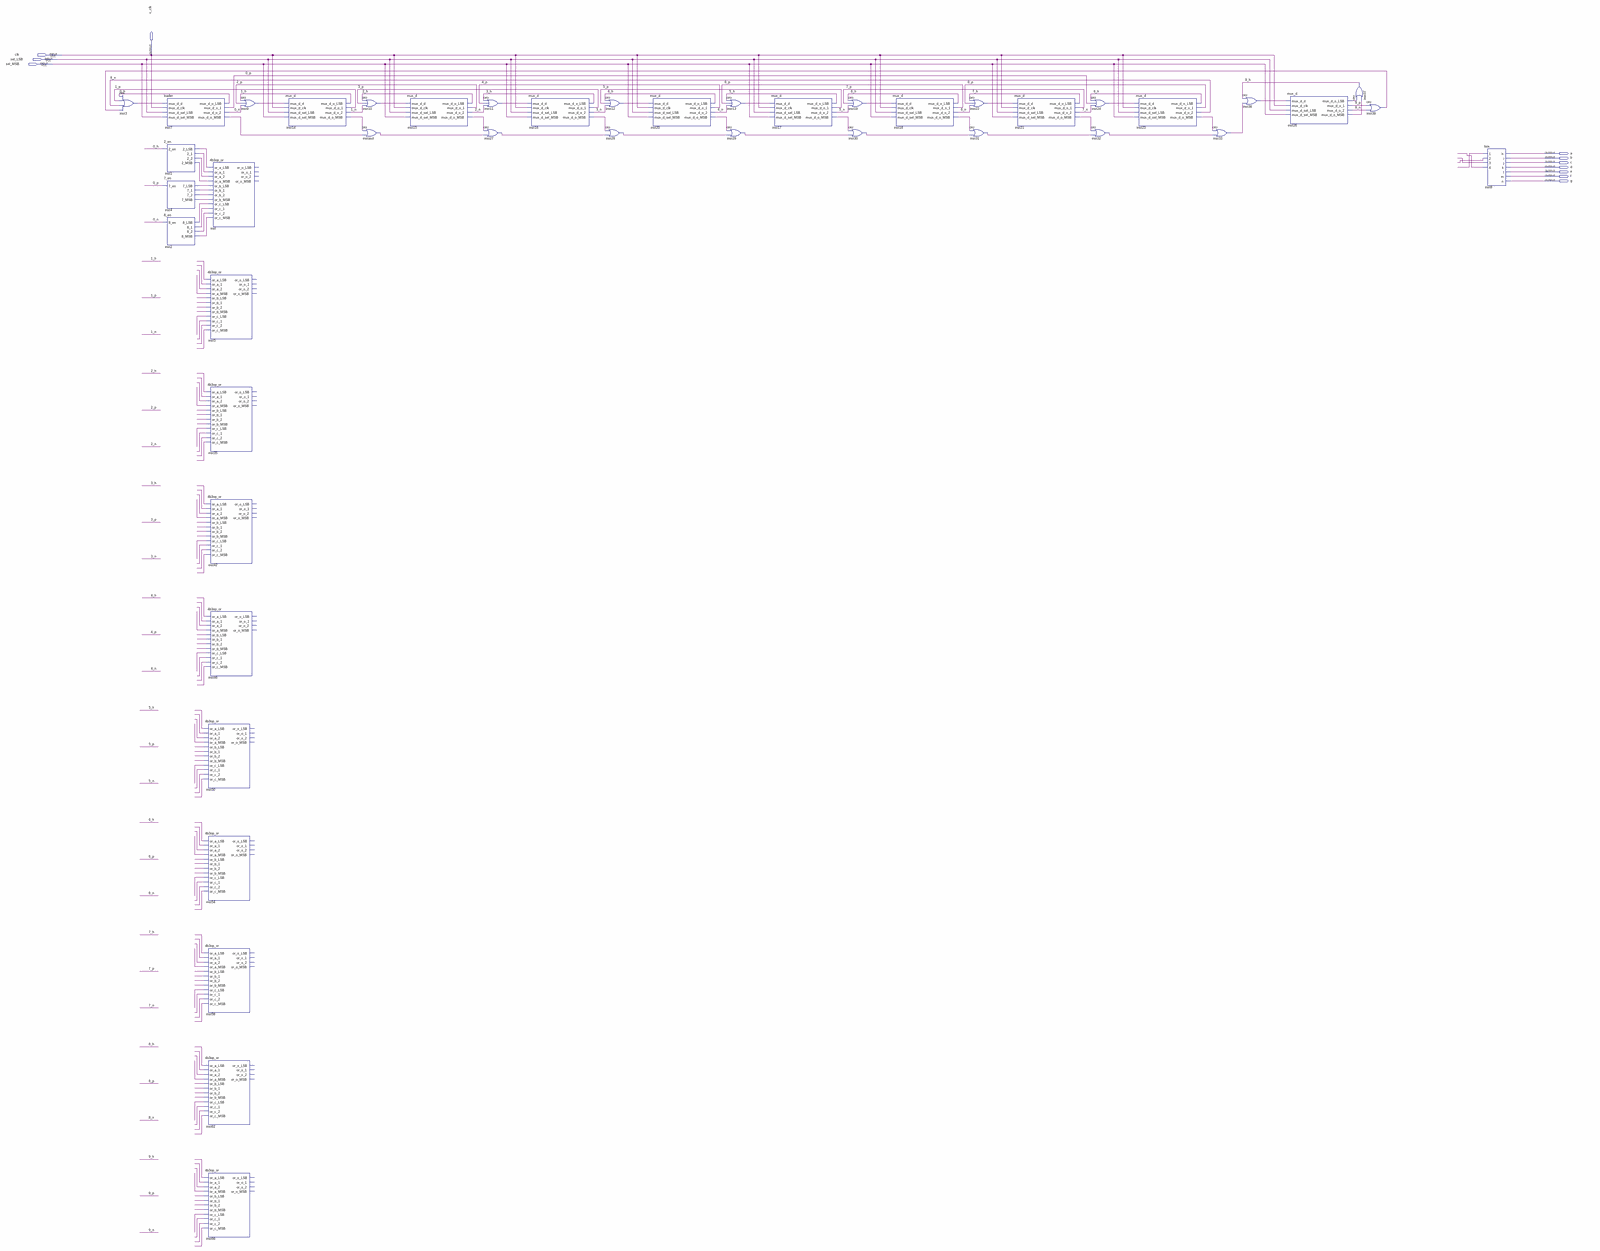
[diagram p0: schematic sheet, whole]
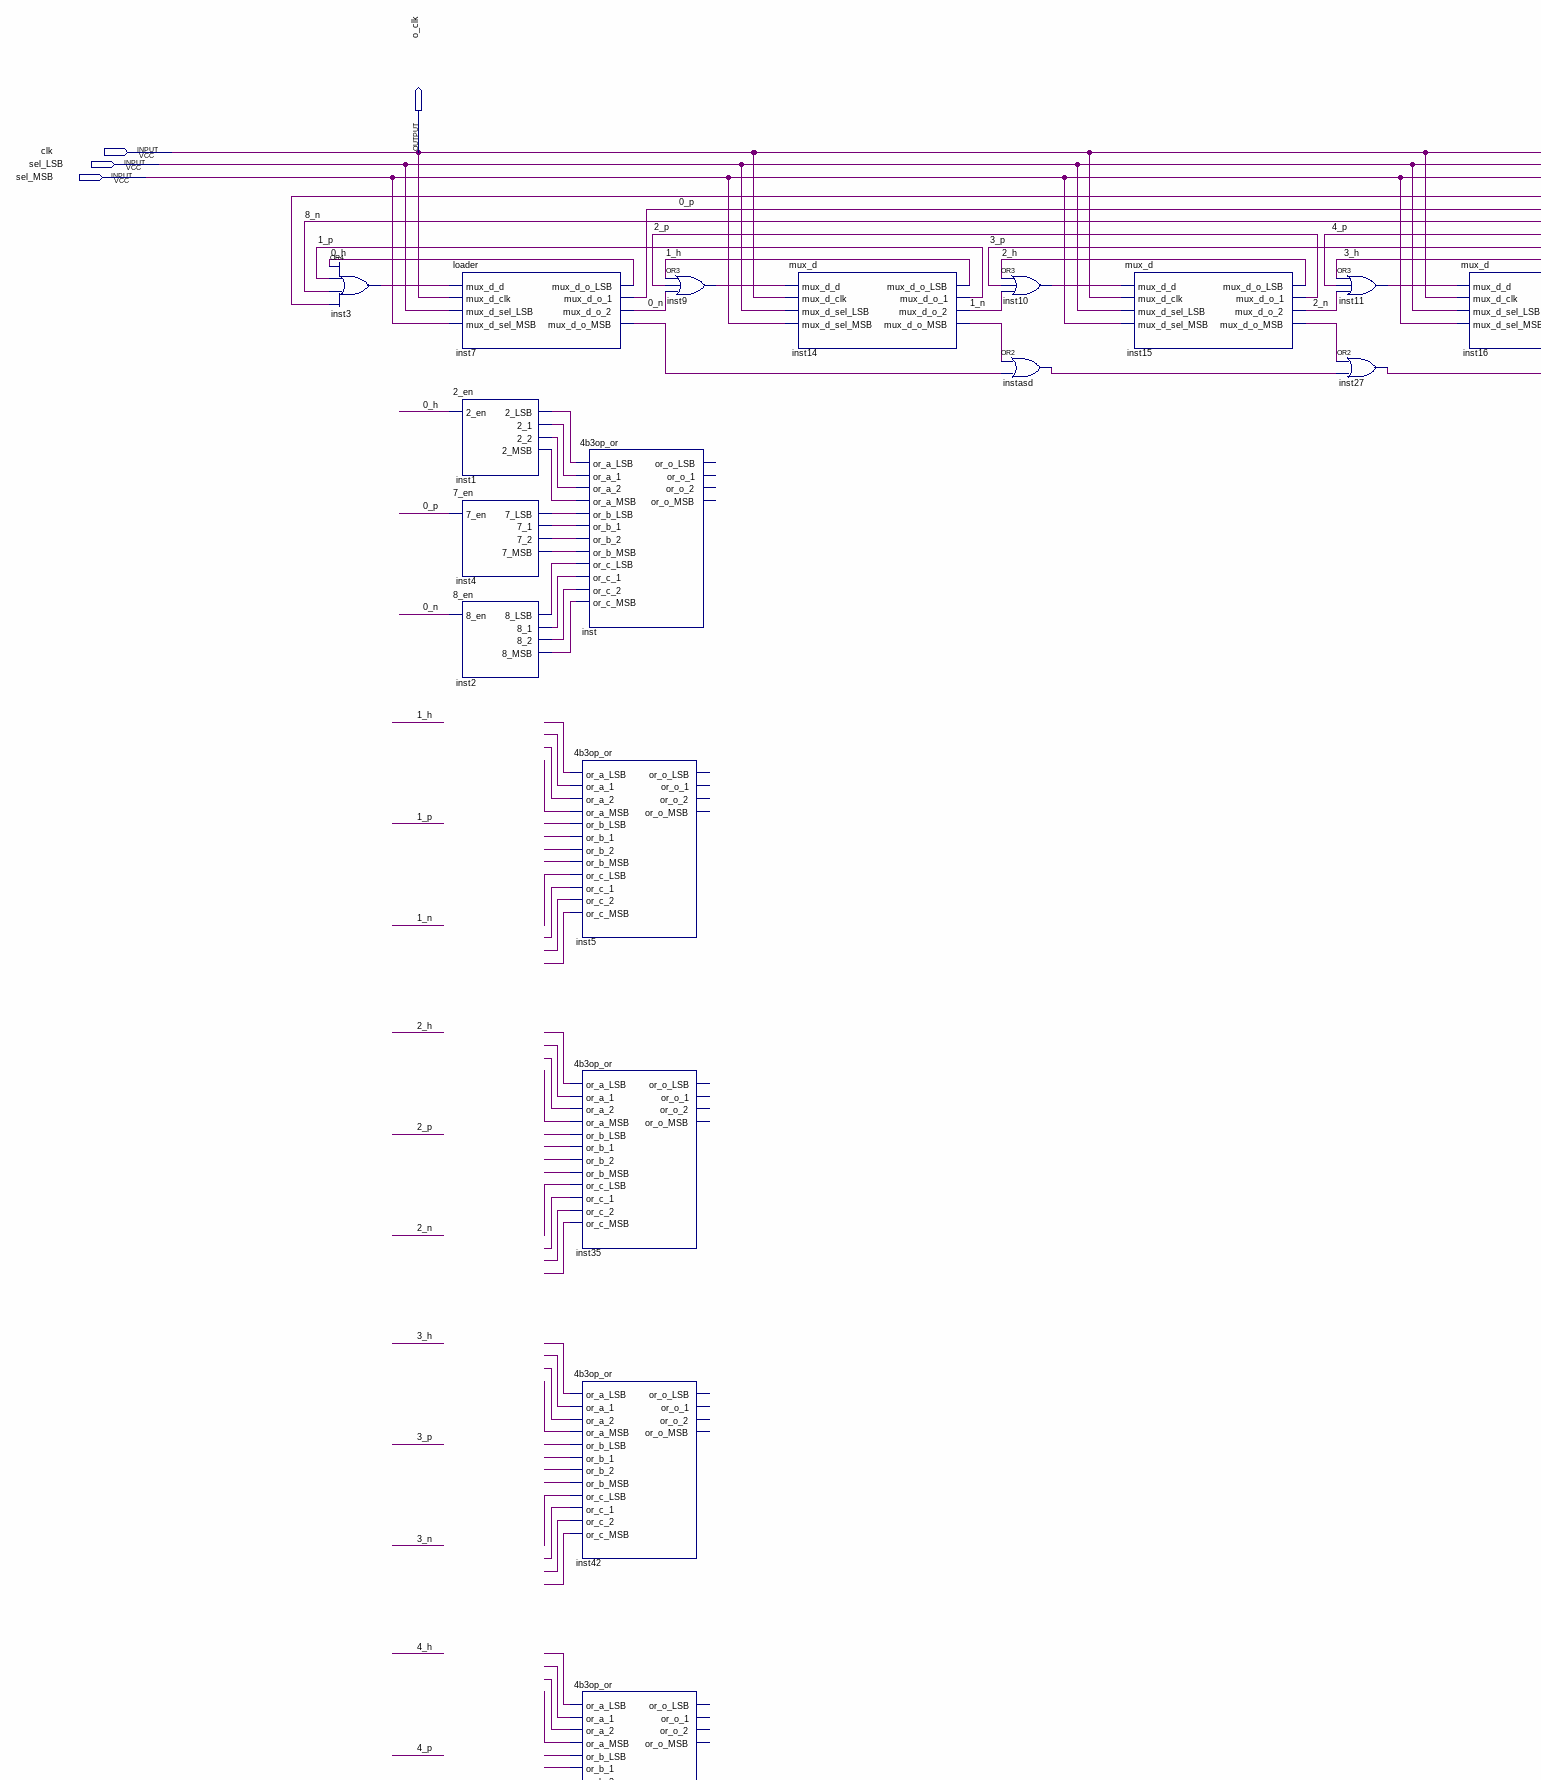
[diagram p1: schematic sheet, upper left part]
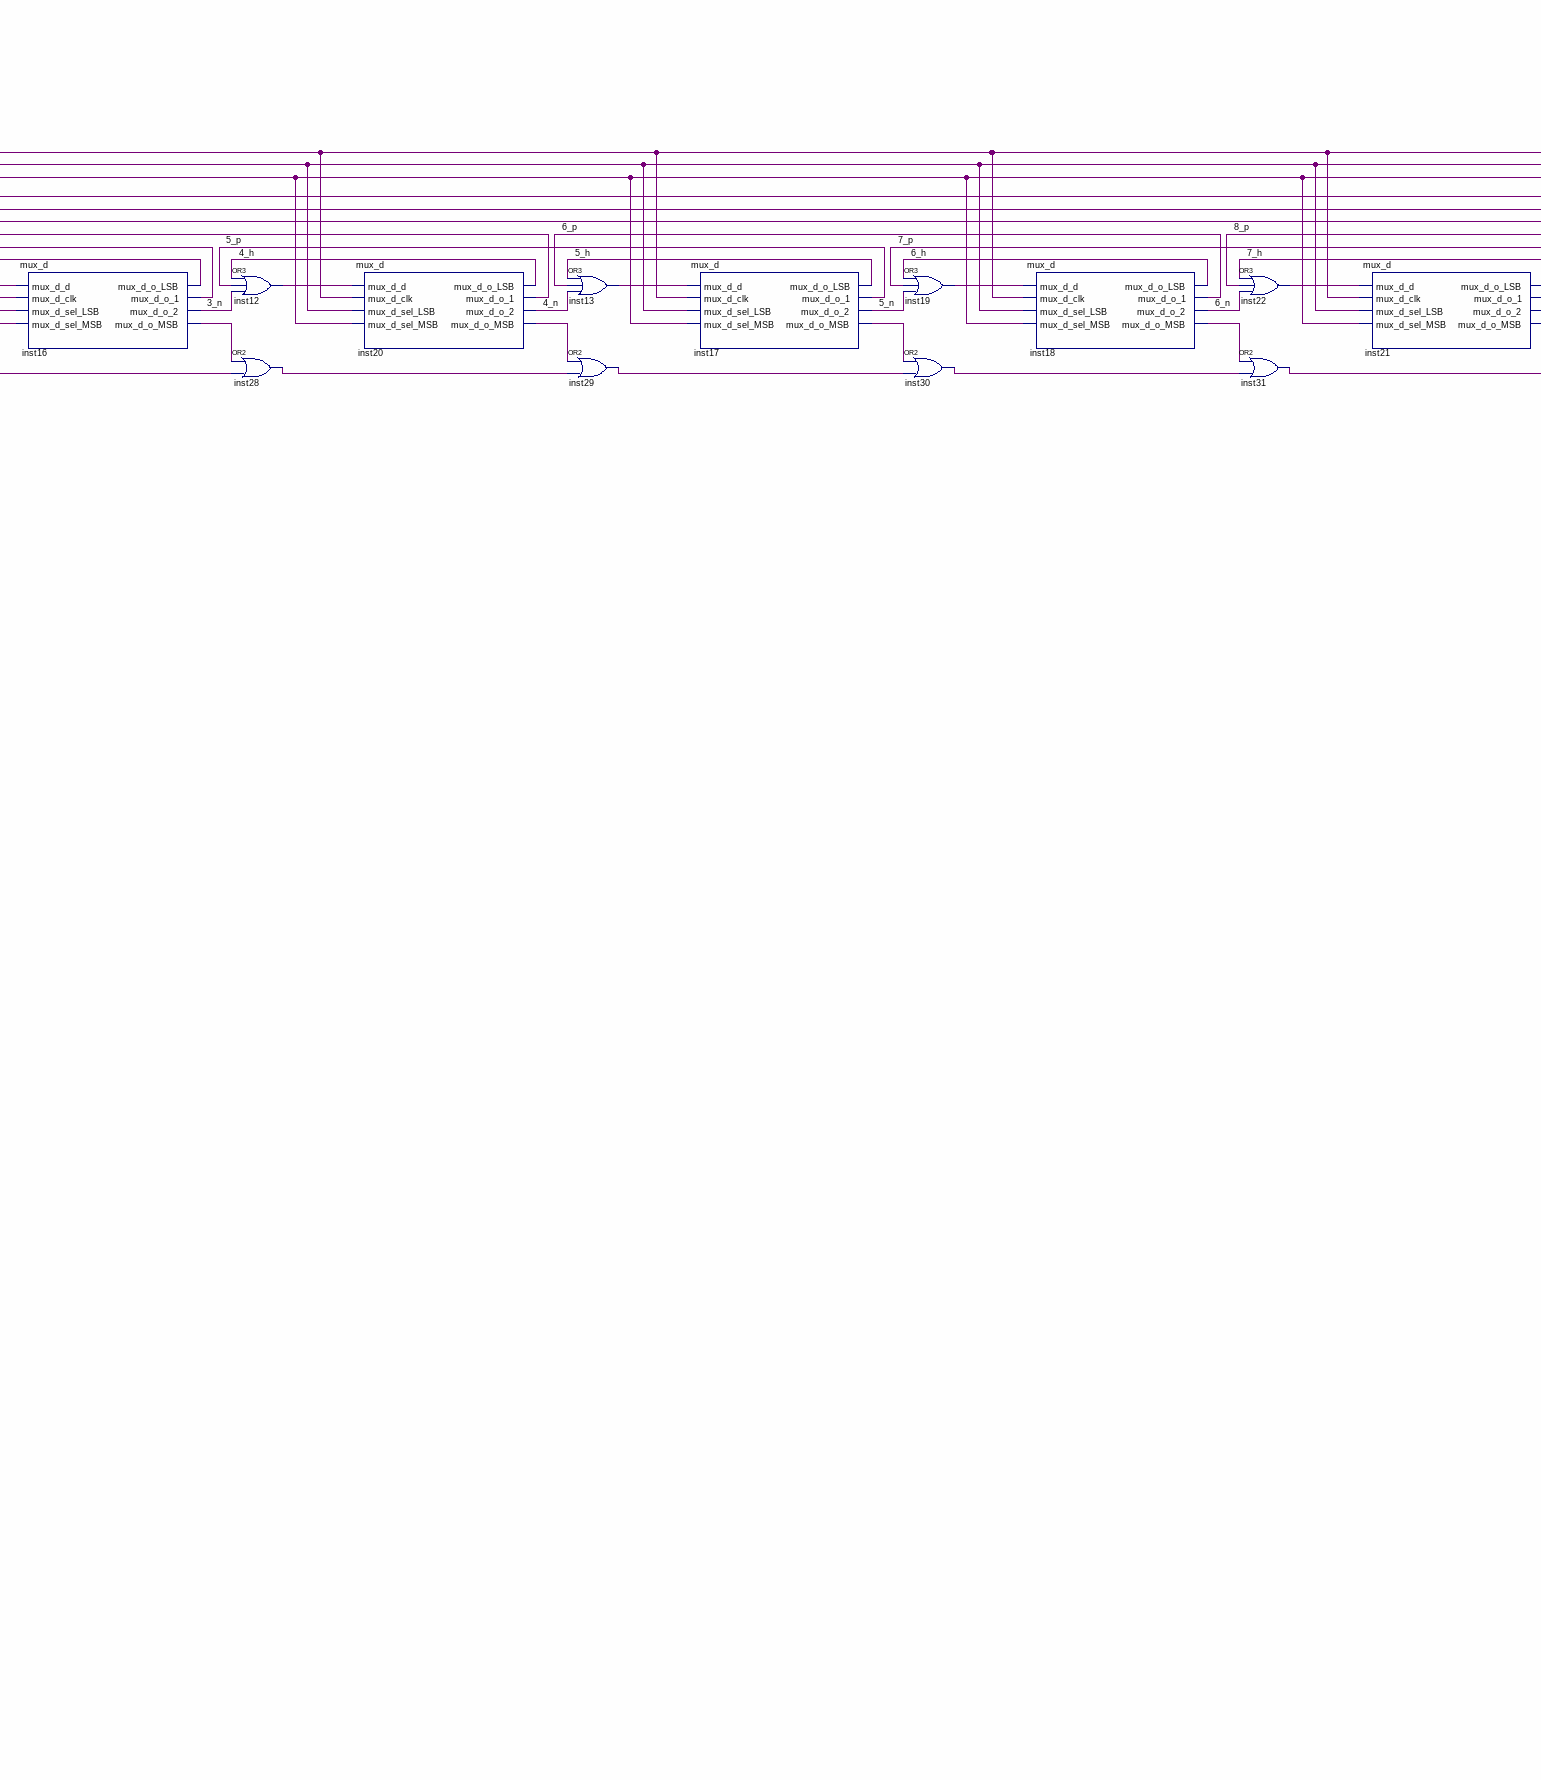
[diagram p2: schematic sheet, upper centre part]
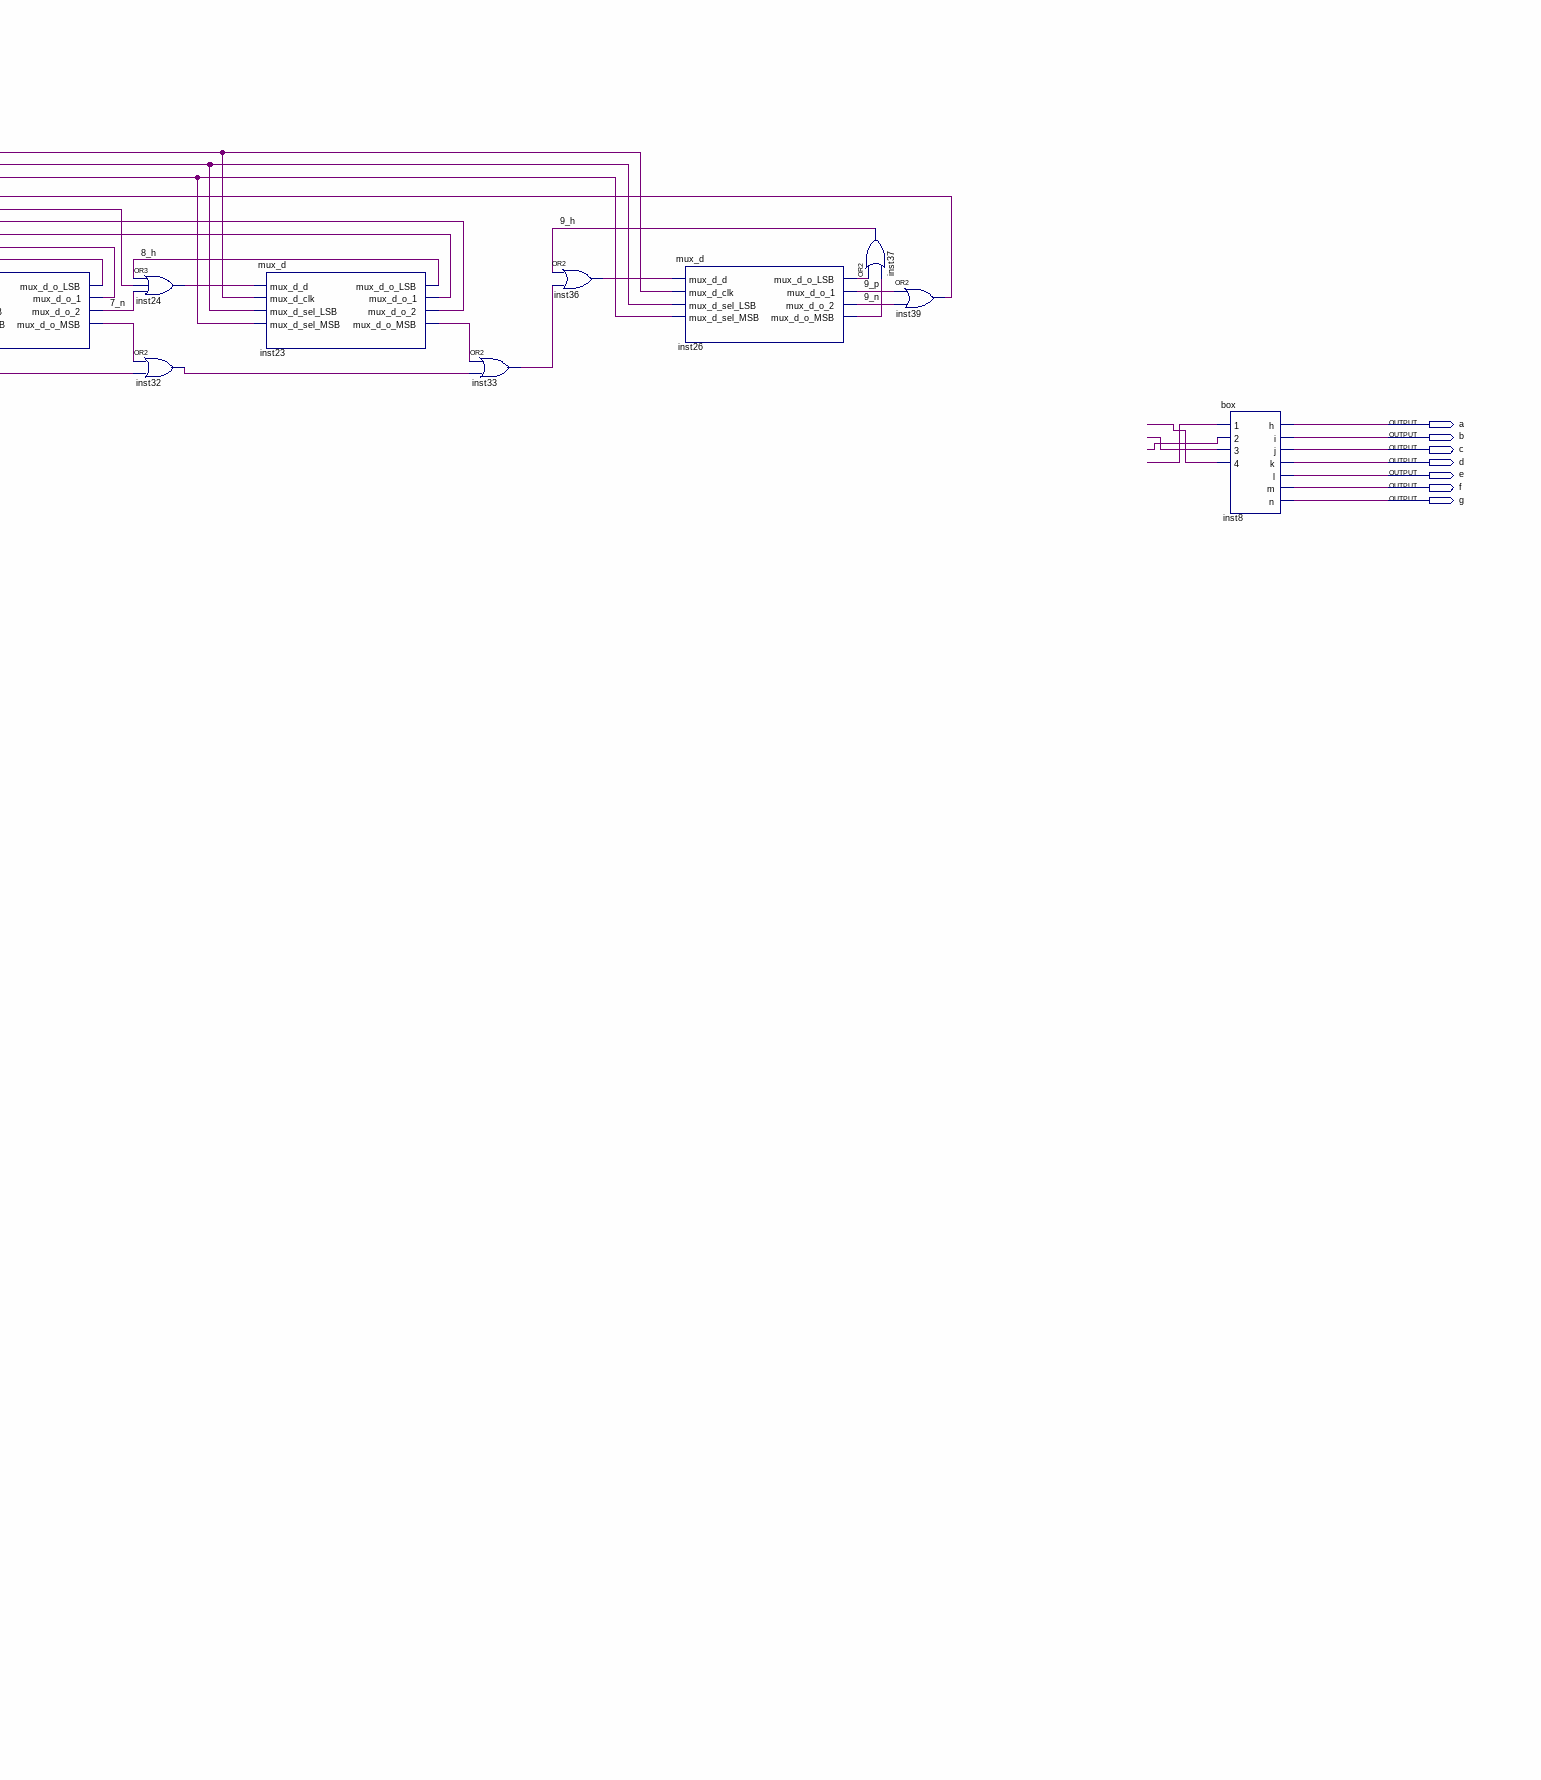
[diagram p3: schematic sheet, upper right part]
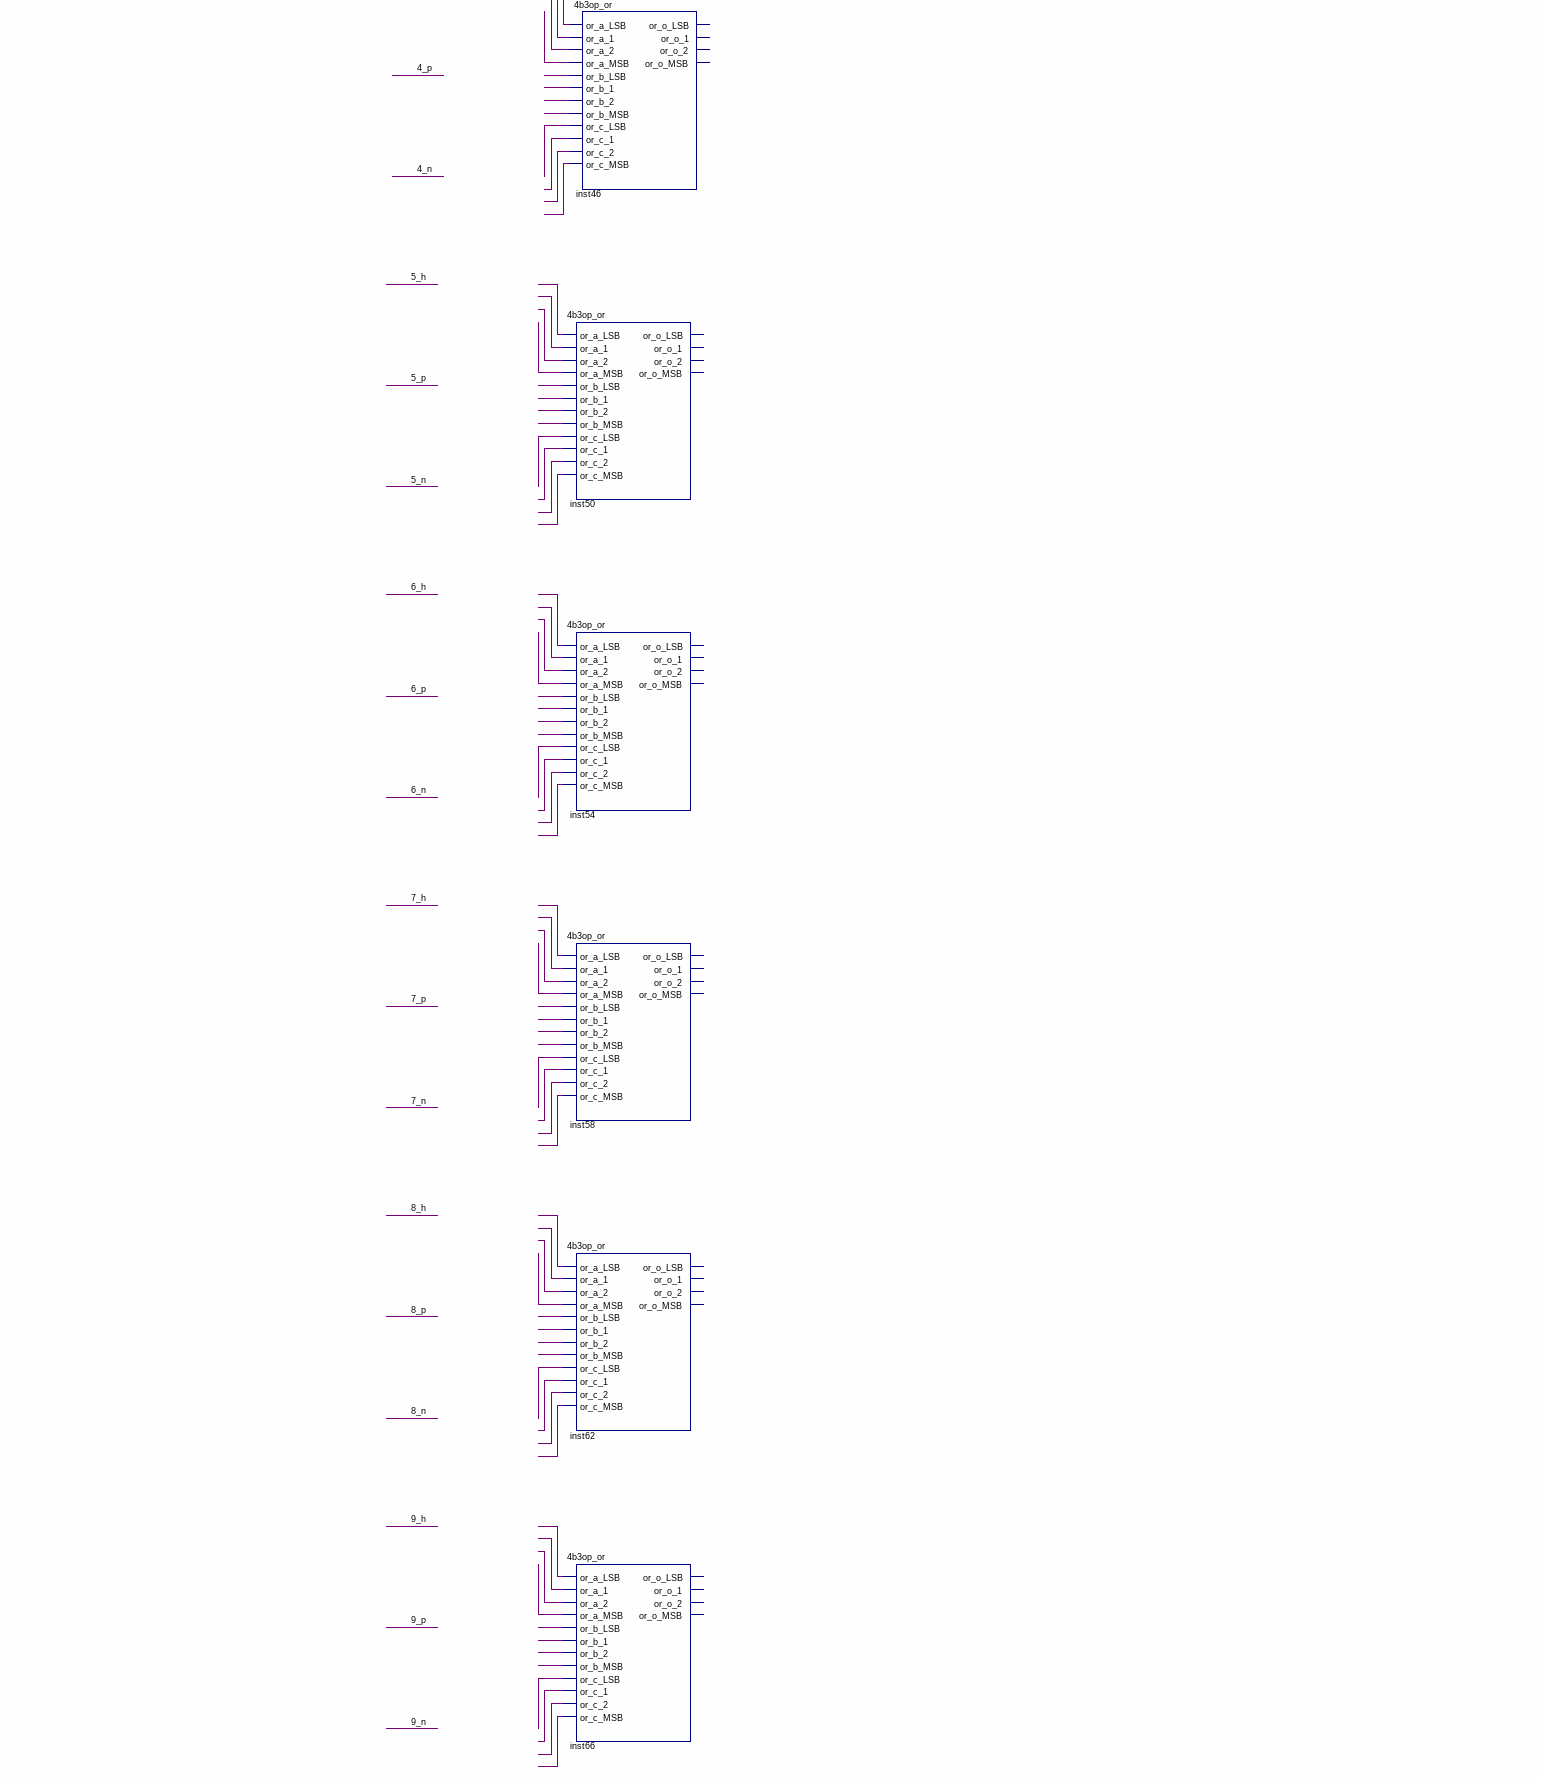
[diagram p4: schematic sheet, lower left part]
// Quartus schematic bcd.bdf as structural Verilog: 44 symbols, 11 pins
module bcd (
  input  clk,
  input  sel_LSB,
  input  sel_MSB,
  output o_clk,
  output a,
  output b,
  output c,
  output d,
  output e,
  output f,
  output g
);

  wire \0_h , \0_n , \0_p , \1_h , \1_n , \1_p , \2_h , \2_n , \2_p , \3_h , \3_n , \3_p , \4_h , \4_n ,
       \4_p , \5_h , \5_n , \5_p , \6_h , \6_n , \6_p , \7_h , \7_n , \7_p , \8_h , \8_n , \8_p , \9_h ,
       \9_n , \9_p , inst1_2_1, inst1_2_2, inst1_2_lsb, inst1_2_msb, inst2_8_1, inst2_8_2, inst2_8_lsb,
       inst2_8_msb, inst3_out, inst4_7_1, inst4_7_2, inst4_7_lsb, inst4_7_msb, inst7_mux_d_o_msb, inst9_out,
       inst10_out, inst11_out, inst12_out, inst13_out, inst14_mux_d_o_msb, inst15_mux_d_o_msb,
       inst16_mux_d_o_msb, inst17_mux_d_o_msb, inst18_mux_d_o_msb, inst19_out, inst20_mux_d_o_msb,
       inst21_mux_d_o_msb, inst22_out, inst23_mux_d_o_msb, inst24_out, inst26_mux_d_o_lsb,
       inst26_mux_d_o_msb, inst27_out, inst28_out, inst29_out, inst30_out, inst31_out, inst32_out,
       inst33_out, inst36_out, inst39_out, instasd_out, undriven, undriven_2, undriven_3, undriven_4,
       undriven_5, undriven_6, undriven_7, undriven_8, undriven_9, undriven_10, undriven_11, undriven_12,
       undriven_13, undriven_14, undriven_15, undriven_16, undriven_17, undriven_18, undriven_19,
       undriven_20, undriven_21, undriven_22, undriven_23, undriven_24, undriven_25, undriven_26,
       undriven_27, undriven_28, undriven_29, undriven_30, undriven_31, undriven_32, undriven_33,
       undriven_34, undriven_35, undriven_36, undriven_37, undriven_38, undriven_39, undriven_40,
       undriven_41, undriven_42, undriven_43, undriven_44, undriven_45, undriven_46, undriven_47,
       undriven_48, undriven_49, undriven_50, undriven_51, undriven_52, undriven_53, undriven_54,
       undriven_55, undriven_56, undriven_57, undriven_58, undriven_59, undriven_60, undriven_61,
       undriven_62, undriven_63, undriven_64, undriven_65, undriven_66, undriven_67, undriven_68,
       undriven_69, undriven_70, undriven_71, undriven_72, undriven_73, undriven_74, undriven_75,
       undriven_76, undriven_77, undriven_78, undriven_79, undriven_80, undriven_81, undriven_82,
       undriven_83, undriven_84, undriven_85, undriven_86, undriven_87, undriven_88, undriven_89,
       undriven_90, undriven_91, undriven_92, undriven_93, undriven_94, undriven_95, undriven_96,
       undriven_97, undriven_98, undriven_99, undriven_100, undriven_101, undriven_102, undriven_103,
       undriven_104, undriven_105, undriven_106, undriven_107, undriven_108, undriven_109, undriven_110,
       undriven_111, undriven_112;

  or inst3 (inst3_out, \0_h , \1_p , \8_n , inst39_out);
  loader inst7 (
    .mux_d_d(inst3_out), .mux_d_clk(clk), .mux_d_sel_LSB(sel_LSB), .mux_d_sel_MSB(sel_MSB),
    .mux_d_o_LSB(\0_h ), .mux_d_o_1(\0_p ), .mux_d_o_2(\0_n ), .mux_d_o_MSB(inst7_mux_d_o_msb));
  \2_en  inst1 (.\2_en (\0_h ), .\2_LSB (inst1_2_lsb), .\2_1 (inst1_2_1), .\2_2 (inst1_2_2), .\2_MSB (inst1_2_msb));
  \7_en  inst4 (.\7_en (\0_p ), .\7_LSB (inst4_7_lsb), .\7_1 (inst4_7_1), .\7_2 (inst4_7_2), .\7_MSB (inst4_7_msb));
  \8_en  inst2 (.\8_en (\0_n ), .\8_LSB (inst2_8_lsb), .\8_1 (inst2_8_1), .\8_2 (inst2_8_2), .\8_MSB (inst2_8_msb));
  \4b3op_or  inst (
    .or_a_LSB(inst1_2_lsb), .or_a_1(inst1_2_1), .or_a_2(inst1_2_2), .or_a_MSB(inst1_2_msb),
    .or_b_LSB(inst4_7_lsb), .or_b_1(inst4_7_1), .or_b_2(inst4_7_2), .or_b_MSB(inst4_7_msb),
    .or_c_LSB(inst2_8_lsb), .or_c_1(inst2_8_1), .or_c_2(inst2_8_2), .or_c_MSB(inst2_8_msb));  // open: or_o_LSB, or_o_1, or_o_2, or_o_MSB
  \4b3op_or  inst5 (
    .or_a_LSB(undriven_8), .or_a_1(undriven_7), .or_a_2(undriven_6), .or_a_MSB(undriven_5),
    .or_b_LSB(undriven_9), .or_b_1(undriven_10), .or_b_2(undriven_11), .or_b_MSB(undriven_12),
    .or_c_LSB(undriven_13), .or_c_1(undriven_14), .or_c_2(undriven_15), .or_c_MSB(undriven_16));  // open: or_o_LSB, or_o_1, or_o_2, or_o_MSB
  \4b3op_or  inst35 (
    .or_a_LSB(undriven_20), .or_a_1(undriven_19), .or_a_2(undriven_18), .or_a_MSB(undriven_17),
    .or_b_LSB(undriven_21), .or_b_1(undriven_22), .or_b_2(undriven_23), .or_b_MSB(undriven_24),
    .or_c_LSB(undriven_25), .or_c_1(undriven_26), .or_c_2(undriven_27), .or_c_MSB(undriven_28));  // open: or_o_LSB, or_o_1, or_o_2, or_o_MSB
  \4b3op_or  inst42 (
    .or_a_LSB(undriven_32), .or_a_1(undriven_31), .or_a_2(undriven_30), .or_a_MSB(undriven_29),
    .or_b_LSB(undriven_33), .or_b_1(undriven_34), .or_b_2(undriven_35), .or_b_MSB(undriven_36),
    .or_c_LSB(undriven_37), .or_c_1(undriven_38), .or_c_2(undriven_39), .or_c_MSB(undriven_40));  // open: or_o_LSB, or_o_1, or_o_2, or_o_MSB
  \4b3op_or  inst46 (
    .or_a_LSB(undriven_44), .or_a_1(undriven_43), .or_a_2(undriven_42), .or_a_MSB(undriven_41),
    .or_b_LSB(undriven_45), .or_b_1(undriven_46), .or_b_2(undriven_47), .or_b_MSB(undriven_48),
    .or_c_LSB(undriven_49), .or_c_1(undriven_50), .or_c_2(undriven_51), .or_c_MSB(undriven_52));  // open: or_o_LSB, or_o_1, or_o_2, or_o_MSB
  \4b3op_or  inst50 (
    .or_a_LSB(undriven_56), .or_a_1(undriven_55), .or_a_2(undriven_54), .or_a_MSB(undriven_53),
    .or_b_LSB(undriven_57), .or_b_1(undriven_58), .or_b_2(undriven_59), .or_b_MSB(undriven_60),
    .or_c_LSB(undriven_61), .or_c_1(undriven_62), .or_c_2(undriven_63), .or_c_MSB(undriven_64));  // open: or_o_LSB, or_o_1, or_o_2, or_o_MSB
  \4b3op_or  inst54 (
    .or_a_LSB(undriven_68), .or_a_1(undriven_67), .or_a_2(undriven_66), .or_a_MSB(undriven_65),
    .or_b_LSB(undriven_69), .or_b_1(undriven_70), .or_b_2(undriven_71), .or_b_MSB(undriven_72),
    .or_c_LSB(undriven_73), .or_c_1(undriven_74), .or_c_2(undriven_75), .or_c_MSB(undriven_76));  // open: or_o_LSB, or_o_1, or_o_2, or_o_MSB
  \4b3op_or  inst58 (
    .or_a_LSB(undriven_80), .or_a_1(undriven_79), .or_a_2(undriven_78), .or_a_MSB(undriven_77),
    .or_b_LSB(undriven_81), .or_b_1(undriven_82), .or_b_2(undriven_83), .or_b_MSB(undriven_84),
    .or_c_LSB(undriven_85), .or_c_1(undriven_86), .or_c_2(undriven_87), .or_c_MSB(undriven_88));  // open: or_o_LSB, or_o_1, or_o_2, or_o_MSB
  \4b3op_or  inst62 (
    .or_a_LSB(undriven_92), .or_a_1(undriven_91), .or_a_2(undriven_90), .or_a_MSB(undriven_89),
    .or_b_LSB(undriven_93), .or_b_1(undriven_94), .or_b_2(undriven_95), .or_b_MSB(undriven_96),
    .or_c_LSB(undriven_97), .or_c_1(undriven_98), .or_c_2(undriven_99), .or_c_MSB(undriven_100));  // open: or_o_LSB, or_o_1, or_o_2, or_o_MSB
  \4b3op_or  inst66 (
    .or_a_LSB(undriven_104), .or_a_1(undriven_103), .or_a_2(undriven_102), .or_a_MSB(undriven_101),
    .or_b_LSB(undriven_105), .or_b_1(undriven_106), .or_b_2(undriven_107), .or_b_MSB(undriven_108),
    .or_c_LSB(undriven_109), .or_c_1(undriven_110), .or_c_2(undriven_111), .or_c_MSB(undriven_112));  // open: or_o_LSB, or_o_1, or_o_2, or_o_MSB
  or inst9 (inst9_out, \1_h , \2_p , \0_n );
  mux_d inst14 (
    .mux_d_d(inst9_out), .mux_d_clk(clk), .mux_d_sel_LSB(sel_LSB), .mux_d_sel_MSB(sel_MSB),
    .mux_d_o_LSB(\1_h ), .mux_d_o_1(\1_p ), .mux_d_o_2(\1_n ), .mux_d_o_MSB(inst14_mux_d_o_msb));
  or inst10 (inst10_out, \2_h , \3_p , \1_n );
  or instasd (instasd_out, inst14_mux_d_o_msb, inst7_mux_d_o_msb);
  mux_d inst15 (
    .mux_d_d(inst10_out), .mux_d_clk(clk), .mux_d_sel_LSB(sel_LSB), .mux_d_sel_MSB(sel_MSB),
    .mux_d_o_LSB(\2_h ), .mux_d_o_1(\2_p ), .mux_d_o_2(\2_n ), .mux_d_o_MSB(inst15_mux_d_o_msb));
  or inst11 (inst11_out, \3_h , \4_p , \2_n );
  or inst27 (inst27_out, inst15_mux_d_o_msb, instasd_out);
  mux_d inst16 (
    .mux_d_d(inst11_out), .mux_d_clk(clk), .mux_d_sel_LSB(sel_LSB), .mux_d_sel_MSB(sel_MSB),
    .mux_d_o_LSB(\3_h ), .mux_d_o_1(\3_p ), .mux_d_o_2(\3_n ), .mux_d_o_MSB(inst16_mux_d_o_msb));
  or inst12 (inst12_out, \4_h , \5_p , \3_n );
  or inst28 (inst28_out, inst16_mux_d_o_msb, inst27_out);
  mux_d inst20 (
    .mux_d_d(inst12_out), .mux_d_clk(clk), .mux_d_sel_LSB(sel_LSB), .mux_d_sel_MSB(sel_MSB),
    .mux_d_o_LSB(\4_h ), .mux_d_o_1(\4_p ), .mux_d_o_2(\4_n ), .mux_d_o_MSB(inst20_mux_d_o_msb));
  or inst13 (inst13_out, \5_h , \6_p , \4_n );
  or inst29 (inst29_out, inst20_mux_d_o_msb, inst28_out);
  mux_d inst17 (
    .mux_d_d(inst13_out), .mux_d_clk(clk), .mux_d_sel_LSB(sel_LSB), .mux_d_sel_MSB(sel_MSB),
    .mux_d_o_LSB(\5_h ), .mux_d_o_1(\5_p ), .mux_d_o_2(\5_n ), .mux_d_o_MSB(inst17_mux_d_o_msb));
  or inst19 (inst19_out, \6_h , \7_p , \5_n );
  or inst30 (inst30_out, inst17_mux_d_o_msb, inst29_out);
  mux_d inst18 (
    .mux_d_d(inst19_out), .mux_d_clk(clk), .mux_d_sel_LSB(sel_LSB), .mux_d_sel_MSB(sel_MSB),
    .mux_d_o_LSB(\6_h ), .mux_d_o_1(\6_p ), .mux_d_o_2(\6_n ), .mux_d_o_MSB(inst18_mux_d_o_msb));
  or inst22 (inst22_out, \7_h , \8_p , \6_n );
  or inst31 (inst31_out, inst18_mux_d_o_msb, inst30_out);
  mux_d inst21 (
    .mux_d_d(inst22_out), .mux_d_clk(clk), .mux_d_sel_LSB(sel_LSB), .mux_d_sel_MSB(sel_MSB),
    .mux_d_o_LSB(\7_h ), .mux_d_o_1(\7_p ), .mux_d_o_2(\7_n ), .mux_d_o_MSB(inst21_mux_d_o_msb));
  or inst24 (inst24_out, \8_h , \0_p , \7_n );
  or inst32 (inst32_out, inst21_mux_d_o_msb, inst31_out);
  mux_d inst23 (
    .mux_d_d(inst24_out), .mux_d_clk(clk), .mux_d_sel_LSB(sel_LSB), .mux_d_sel_MSB(sel_MSB),
    .mux_d_o_LSB(\8_h ), .mux_d_o_1(\8_p ), .mux_d_o_2(\8_n ), .mux_d_o_MSB(inst23_mux_d_o_msb));
  or inst33 (inst33_out, inst23_mux_d_o_msb, inst32_out);
  or inst36 (inst36_out, \9_h , inst33_out);
  mux_d inst26 (
    .mux_d_d(inst36_out), .mux_d_clk(clk), .mux_d_sel_LSB(sel_LSB), .mux_d_sel_MSB(sel_MSB),
    .mux_d_o_LSB(inst26_mux_d_o_lsb), .mux_d_o_1(\9_p ), .mux_d_o_2(\9_n ), .mux_d_o_MSB(inst26_mux_d_o_msb));
  or inst37 (\9_h , inst26_mux_d_o_lsb, inst26_mux_d_o_msb);
  or inst39 (inst39_out, \9_p , \9_n );
  box inst8 (
    .\1 (undriven), .\2 (undriven_4), .\3 (undriven_3), .\4 (undriven_2), .h(a), .i(b), .j(c), .k(d), .l(e),
    .m(f), .n(g));

  assign o_clk = clk;
endmodule
